# EAGLE schematic 3X3LEDCube (EAGLE 7.6.0)
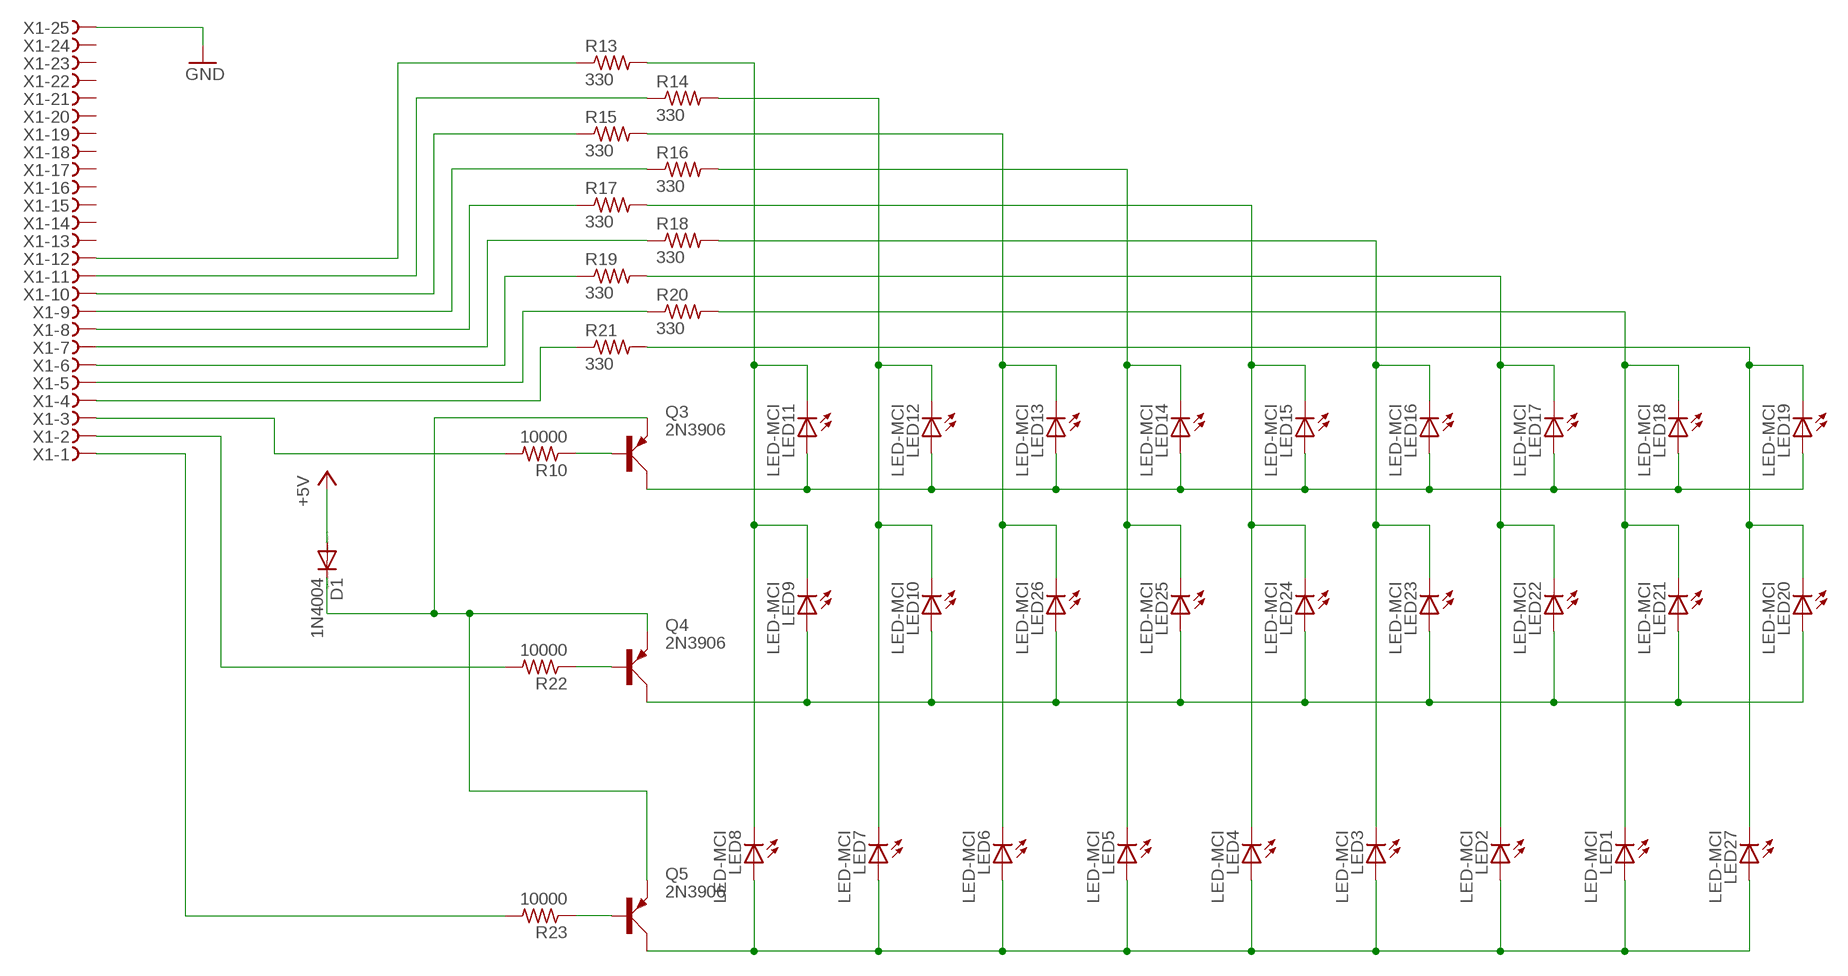
[diagram p0: schematic, sheet 1]

## Parts
D1  1N4004  [DO41-10]
LED1  LED-MCI  [LED-MCI]
LED2  LED-MCI  [LED-MCI]
LED3  LED-MCI  [LED-MCI]
LED4  LED-MCI  [LED-MCI]
LED5  LED-MCI  [LED-MCI]
LED6  LED-MCI  [LED-MCI]
LED7  LED-MCI  [LED-MCI]
LED8  LED-MCI  [LED-MCI]
LED9  LED-MCI  [LED-MCI]
LED10  LED-MCI  [LED-MCI]
LED11  LED-MCI  [LED-MCI]
LED12  LED-MCI  [LED-MCI]
LED13  LED-MCI  [LED-MCI]
LED14  LED-MCI  [LED-MCI]
LED15  LED-MCI  [LED-MCI]
LED16  LED-MCI  [LED-MCI]
LED17  LED-MCI  [LED-MCI]
LED18  LED-MCI  [LED-MCI]
LED19  LED-MCI  [LED-MCI]
LED20  LED-MCI  [LED-MCI]
LED21  LED-MCI  [LED-MCI]
LED22  LED-MCI  [LED-MCI]
LED23  LED-MCI  [LED-MCI]
LED24  LED-MCI  [LED-MCI]
LED25  LED-MCI  [LED-MCI]
LED26  LED-MCI  [LED-MCI]
LED27  LED-MCI  [LED-MCI]
Q3  2N3906  [TO92D]
Q4  2N3906  [TO92D]
Q5  2N3906  [TO92D]
R10  10000  RESISTOR-MCI  [RESISTOR-MCI]
R13  330  RESISTOR-MCI  [RESISTOR-MCI]
R14  330  RESISTOR-MCI  [RESISTOR-MCI]
R15  330  RESISTOR-MCI  [RESISTOR-MCI]
R16  330  RESISTOR-MCI  [RESISTOR-MCI]
R17  330  RESISTOR-MCI  [RESISTOR-MCI]
R18  330  RESISTOR-MCI  [RESISTOR-MCI]
R19  330  RESISTOR-MCI  [RESISTOR-MCI]
R20  330  RESISTOR-MCI  [RESISTOR-MCI]
R21  330  RESISTOR-MCI  [RESISTOR-MCI]
R22  10000  RESISTOR-MCI  [RESISTOR-MCI]
R23  10000  RESISTOR-MCI  [RESISTOR-MCI]
X1  F25.590S  [177-025-FEMALE]

## Nets
+5V: D1.A
GND: X1.25
N$1: R23.2 X1.1
N$2: R22.2 X1.2
N$3: R10.2 X1.3
N$4: R21.1 X1.4
N$5: R20.1 X1.5
N$6: R19.1 X1.6
N$7: R18.1 X1.7
N$8: R17.1 X1.8
N$9: R16.1 X1.9
N$10: LED8.1(C) LED9.1(C) LED11.1(C) LED11.2(A) LED12.2(A) LED13.2(A) LED14.2(A) LED15.2(A) LED16.2(A) LED17.2(A) LED18.2(A) LED19.2(A) Q3.C R13.2
N$11: R15.1 X1.10
N$12: LED7.1(C) LED10.1(C) LED12.1(C) R14.2
N$13: LED6.1(C) LED13.1(C) LED26.1(C) R15.2
N$14: LED5.1(C) LED14.1(C) LED25.1(C) R16.2
N$15: LED4.1(C) LED15.1(C) LED24.1(C) R17.2
N$16: LED3.1(C) LED16.1(C) LED23.1(C) R18.2
N$17: LED2.1(C) LED17.1(C) LED22.1(C) R19.2
N$18: LED1.1(C) LED18.1(C) LED21.1(C) R20.2
N$19: LED19.1(C) LED20.1(C) LED27.1(C) R21.2
N$20: LED9.2(A) LED10.2(A) LED20.2(A) LED21.2(A) LED22.2(A) LED23.2(A) LED24.2(A) LED25.2(A) LED26.2(A) Q4.C
N$21: LED1.2(A) LED2.2(A) LED3.2(A) LED4.2(A) LED5.2(A) LED6.2(A) LED7.2(A) LED8.2(A) LED27.2(A) Q5.C
N$22: R14.1 X1.11
N$23: R13.1 X1.12
N$24: D1.C Q3.E Q4.E Q5.E
N$25: Q4.B R22.1
N$26: Q5.B R23.1
N$27: Q3.B R10.1
Unconnected: X1.13 X1.14 X1.15 X1.16 X1.17 X1.18 X1.19 X1.20 X1.21 X1.22 X1.23 X1.24

## Library data of the parts
D1 = diode:1N4004: DIODE general purpose rectifier, 1 A
LED1-LED27 = mci-Mar29-09:LED-MCI: Blinkie LED
Q3-Q5 = transistor-small-signal:2N3906: PNP TRANSISTOR
R10 R13-R23 = mci-Mar29-09:RESISTOR-MCI: Blinkie resistor
X1 = con-subd:F25?S: SUB-D; OC_FARNELL: unknown; OC_NEWARK: unknown